# Altium schematic sheet analog_mcu.SchDoc
size A4; SheetNumber: 6; SheetTotal: 14
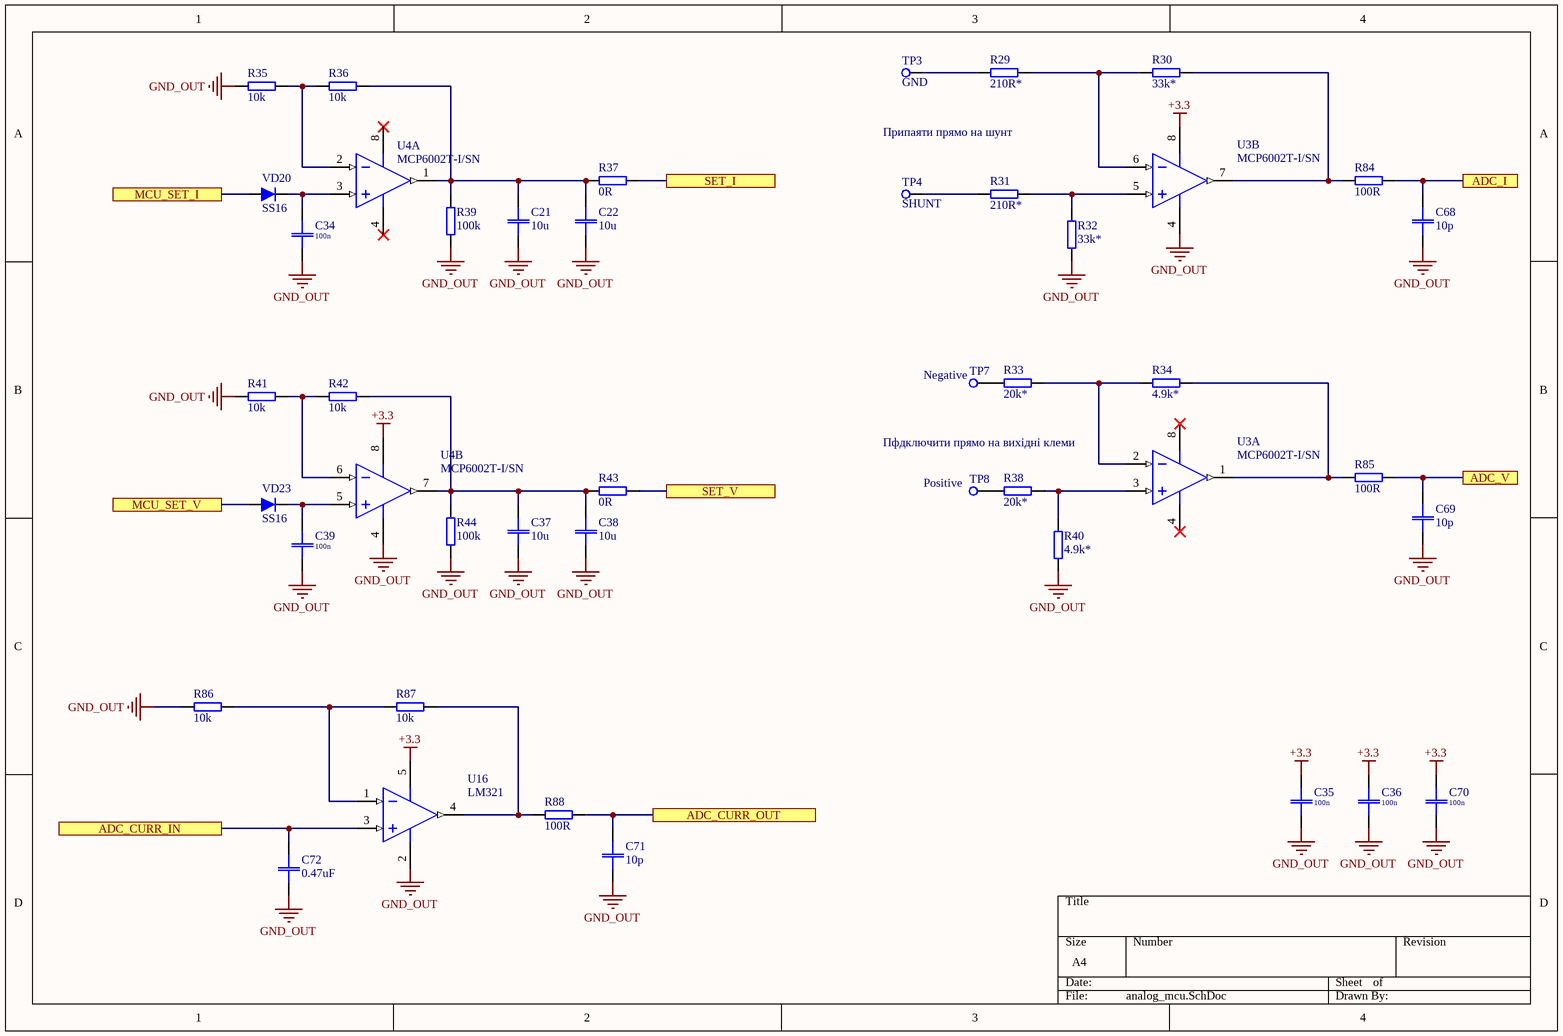
[diagram p0: analog_mcu.SchDoc]

## Parts
C21  10u  [CAP: 0805]
C22  10u  [CAP: 0805]
C34  100n  [C0603]
C35  100n  [C0603]
C36  100n  [C0603]
C37  10u  [CAP: 0805]
C38  10u  [CAP: 0805]
C39  100n  [C0603]
C68  10p  [CAP: 0603]
C69  10p  [CAP: 0603]
C70  100n  [C0603]
C71  10p  [CAP: 0603]
C72  0.47uF  [CAP: 0603]
R29  210R*  [RES: 0603]
R30  33k*  [RES: 0603]
R31  210R*  [RES: 0603]
R32  33k*  [RES: 0603]
R33  20k*  [RES: 0603]
R34  4.9k*  [RES: 0603]
R35  10k  [RES: 0603]
R36  10k  [RES: 0603]
R37  0R  [RES: 0603]
R38  20k*  [RES: 0603]
R39  100k  [RES: 0603]
R40  4.9k*  [RES: 0603]
R41  10k  [RES: 0603]
R42  10k  [RES: 0603]
R43  0R  [RES: 0603]
R44  100k  [RES: 0603]
R84  100R  [RES: 0603]
R85  100R  [RES: 0603]
R86  10k  [RES: 0603]
R87  10k  [RES: 0603]
R88  100R  [RES: 0603]
TP3  GND  [TP: TEST POINT DIP]
TP4  SHUNT  [TP: TEST POINT DIP]
TP7  Negative  [TP: TEST POINT DIP]
TP8  Positive  [TP: TEST POINT DIP]
U3  MCP6002T-I/SN  [SOIC-SN8_N]  (parts A,B of 2)
U4  MCP6002T-I/SN  [SOIC-SN8_N]  (parts A,B of 2)
U16  LM321  [SOT23-5]
VD20  SS16  [DIODE: SOD123]
VD23  SS16  [DIODE: SOD123]

## Ports
ADC_CURR_IN, ADC_CURR_OUT, ADC_I, ADC_V, MCU_SET_I, MCU_SET_V, SET_I, SET_V

## Nets
+3.3: C35.1 C36.1 C70.1 U3.8(VDD) U4.8(VDD) U16.5(V+)
GND_OUT: C21.1 C22.1 C34.1 C35.2 C36.2 C37.1 C38.1 C39.1 C68.1 C69.1 C70.2 C71.1 C72.1 R32.1 R35.1 R39.1 R40.2 R41.1 R44.1 R86.1 U3.4(VSS) U4.4(VSS) U16.2(V-)
ADC_CURR_IN: C72.2 U16.3(IN+) ; port ADC_CURR_IN
ADC_CURR_OUT: C71.2 R88.2 ; port ADC_CURR_OUT
ADC_I: C68.2 R84.2 ; port ADC_I
ADC_V: C69.2 R85.2 ; port ADC_V
MCU_SET_I: VD20.1(A) ; port MCU_SET_I
MCU_SET_V: VD23.1(A) ; port MCU_SET_V
SET_I: R37.1 ; port SET_I
SET_V: R43.1 ; port SET_V
NetC21_2: C21.2 C22.2 R36.2 R37.2 R39.2 U4.1(VOUTA)
NetC34_2: C34.2 U4.3(VINA+) VD20.2(C)
NetC37_2: C37.2 C38.2 R42.2 R43.2 R44.2 U4.7(VOUTB)
NetC39_2: C39.2 U4.5(VINB+) VD23.2(C)
NetR29_1: R29.1 TP3.1
NetR29_2: R29.2 R30.1 U3.6(VINB-)
NetR30_2: R30.2 R84.1 U3.7(VOUTB)
NetR31_1: R31.1 TP4.1
NetR31_2: R31.2 R32.2 U3.5(VINB+)
NetR33_1: R33.1 TP7.1
NetR33_2: R33.2 R34.1 U3.2(VINA-)
NetR34_2: R34.2 R85.1 U3.1(VOUTA)
NetR35_2: R35.2 R36.1 U4.2(VINA-)
NetR38_1: R38.1 TP8.1
NetR38_2: R38.2 R40.1 U3.3(VINA+)
NetR41_2: R41.2 R42.1 U4.6(VINB-)
NetR86_2: R86.2 R87.1 U16.1(IN-)
NetR87_2: R87.2 R88.1 U16.4(OUT)

## Notes on the sheet
- Припаяти прямо на шунт
- Пфдключити прямо на вихідні клеми

## Library data of the parts
C21 C22 C37 C38 C68 C69 C71 C72 = C_SMD
  C21 C22 C37 C38: Value: 10u
  C68 C69 C71: Value: 10p
  C72: Value: 0.47uF
C34-C36 C39 C70 = C-0603: SMD-0603; Price: 0.014; Value: 100n
R29-R44 R84-R88 = R_SMD
  R29 R31: Value: 210R*
  R30 R32: Value: 33k*
  R33 R38: Value: 20k*
  R34 R40: Value: 4.9k*
  R35 R36 R41 R42 R86 R87: Value: 10k
  R37 R43: Value: 0R
  R39 R44: Value: 100k
  R84 R85 R88: Value: 100R
TP3 TP4 TP7 TP8 = TEST POINT
  TP3: Value: GND
  TP4: Value: SHUNT
  TP7: Value: Negative
  TP8: Value: Positive
U3 U4 = MCP6002T-I/SN: 1 MHz, Low-Power Operational Amplifier, 8-Pin SOIC, Industrial Temperature, Tape and Reel; Published: 29-Jan-2009; DatasheetVersion: revH, May-2008; PackageVersion: revAW, Oct-2008; PackageReference: SOIC-SN8; Publisher: Altium Limited; PackageDescription: 8-Lead Plastic Small Outline (SN) - Narrow, 3.90mm Body [SOIC]; Code_JEDEC: MS-012; Code_IPC: SOIC127P600-8; ComponentLink1Description: Manufacturer Link; ComponentLink1URL: http://www.microchip.com; ComponentLink2Description: Datasheet; ComponentLink2URL: http://ww1.microchip.com/downloads/en/DeviceDoc/21733h.pdf; ComponentLink3Description: Packaging Specification; ComponentLink3URL: http://ww1.microchip.com/downloads/en/PackagingSpec/00049AW.pdf
U16 = LMV611: Value: LM321
VD20 VD23 = DIODE_SMD: Value: SS16